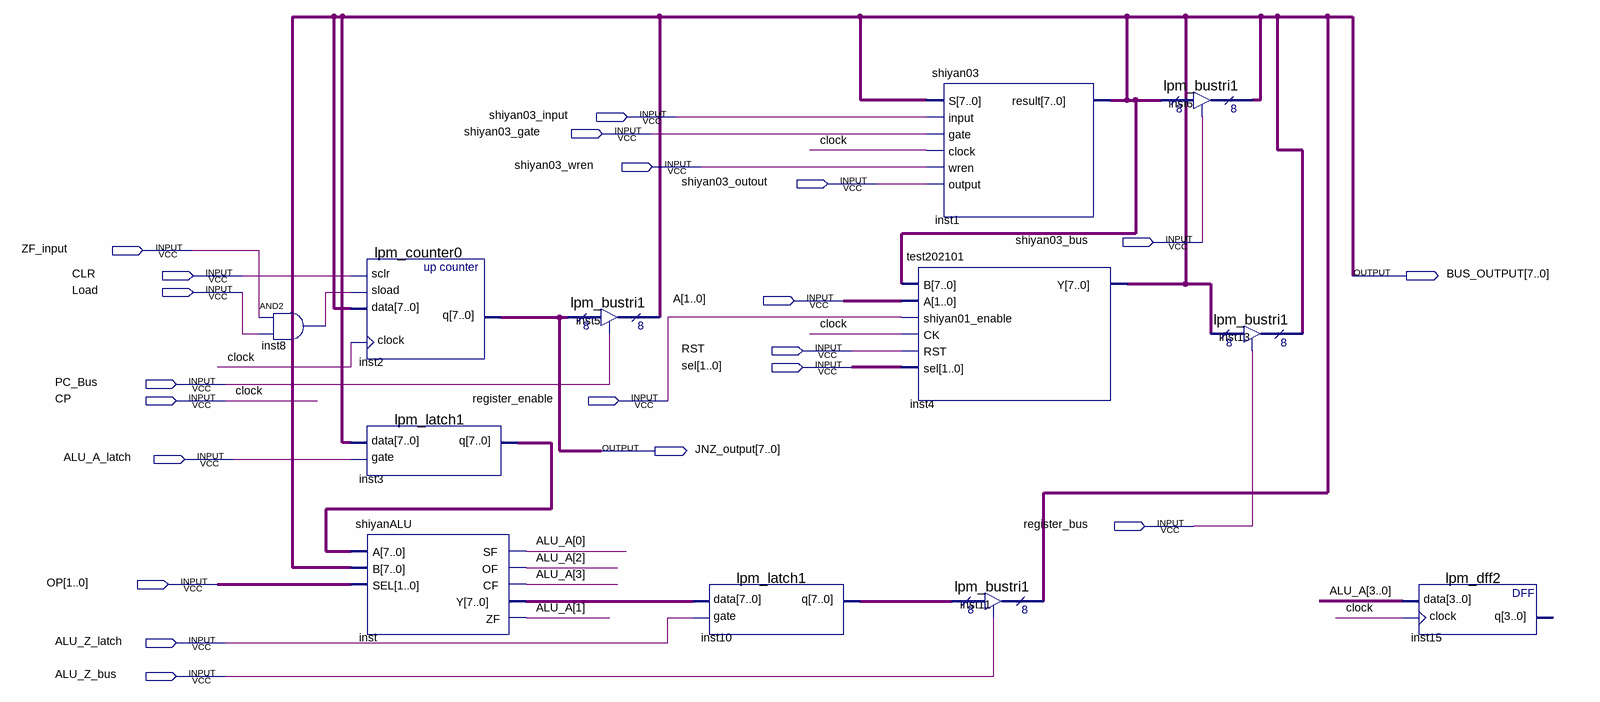
[diagram p0: schematic sheet]
// Quartus schematic shiyan04.bdf as structural Verilog: 12 symbols, 21 pins
module shiyan04 (
  input  shiyan03_input,
  input  shiyan03_gate,
  input  shiyan03_wren,
  input  shiyan03_outout,
  input  shiyan03_bus,
  input  ZF_input,
  input  CLR,
  input  Load,
  input  [1:0] A,
  input  RST,
  input  [1:0] sel,
  input  PC_Bus,
  input  CP,
  input  register_enable,
  input  ALU_A_latch,
  input  register_bus,
  input  [1:0] OP,
  input  ALU_Z_latch,
  input  ALU_Z_bus,
  output [7:0] BUS_OUTPUT,
  output [7:0] JNZ_output
);

  wire inst8_out;
  wire [3:0] ALU_A;
  wire [7:0] inst3_q, inst10_q, inst_y;

  and inst8 (inst8_out, ZF_input, Load);
  lpm_counter0 inst2 (.sclr(CLR), .sload(inst8_out), .data(BUS_OUTPUT), .clock(CP), .q(JNZ_output));
  lpm_latch1 inst3 (.data(BUS_OUTPUT), .gate(ALU_A_latch), .q(inst3_q));
  shiyanALU inst (
    .A(inst3_q), .B(BUS_OUTPUT), .SEL(OP), .SF(ALU_A[0]), .OF(ALU_A[2]), .CF(ALU_A[3]), .Y(inst_y),
    .ZF(ALU_A[1]));
  lpm_bustri1 inst5 (.enabledt(PC_Bus), .data(JNZ_output), .tridata(BUS_OUTPUT));
  lpm_latch1 inst10 (.data(inst_y), .gate(ALU_Z_latch), .q(inst10_q));
  shiyan03 inst1 (
    .S(BUS_OUTPUT), .\input (shiyan03_input), .gate(shiyan03_gate), .clock(CP), .wren(shiyan03_wren),
    .\output (shiyan03_outout), .result(BUS_OUTPUT));
  test202101 inst4 (
    .B(BUS_OUTPUT), .A(A), .shiyan01_enable(register_enable), .CK(CP), .RST(RST), .sel(sel), .Y(BUS_OUTPUT));
  lpm_bustri1 inst11 (.enabledt(ALU_Z_bus), .data(inst10_q), .tridata(BUS_OUTPUT));
  lpm_bustri1 inst6 (.enabledt(shiyan03_bus), .data(BUS_OUTPUT), .tridata(BUS_OUTPUT));
  lpm_bustri1 inst13 (.enabledt(register_bus), .data(BUS_OUTPUT), .tridata(BUS_OUTPUT));
  lpm_dff2 inst15 (.data(ALU_A), .clock(CP));  // open: q

  // Other names for the same wires on the sheet: clock = CP
endmodule
